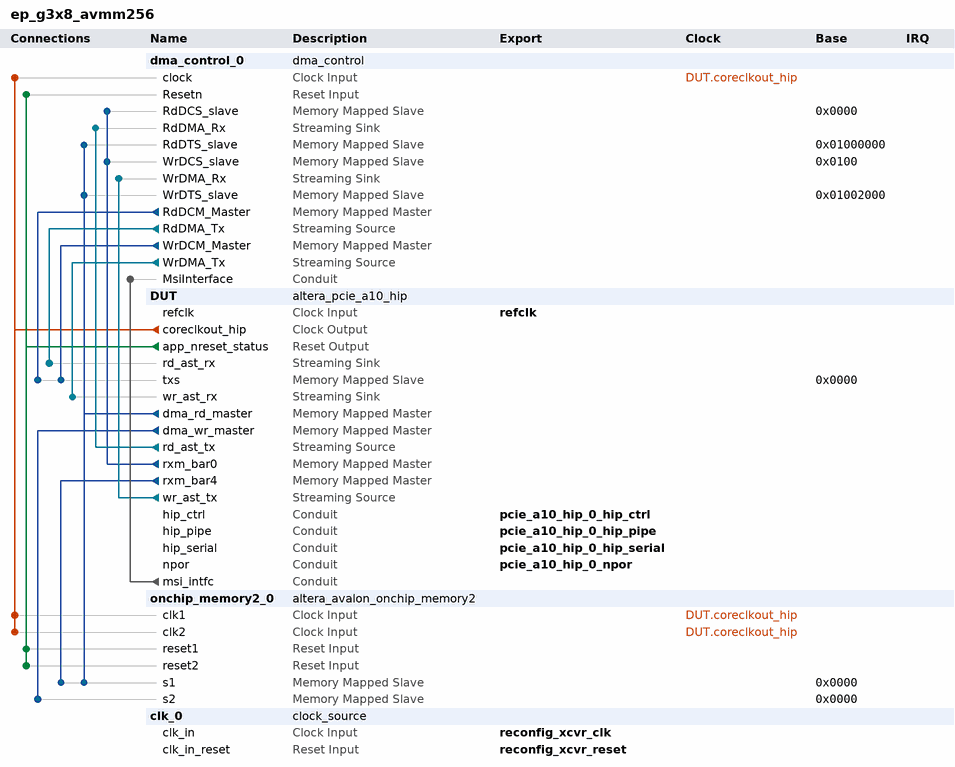
[diagram p0: system contents]
# Platform Designer (Qsys) system ep_g3x8_avmm256, Arria 10 10AT115S2F45E2SG
# Parameters at their usual value, and those the tool derives, are not listed.
package require -exact qsys 1.0
create_system ep_g3x8_avmm256
set_project_property DEVICE_FAMILY {Arria 10}
set_project_property DEVICE 10AT115S2F45E2SG

add_component dma_control_0 ip/ep_g3x8_avmm256/ep_g3x8_avmm256_dma_control_0.ip dma_control dma_control_0 17.1
load_component dma_control_0
set_component_parameter_value DMA_WIDTH 256
save_component

add_component DUT ip/ep_g3x8_avmm256/ep_g3x8_avmm256_DUT.ip altera_pcie_a10_hip DUT 17.1
load_component DUT
set_component_parameter_value interface_type_hwtcl {Avalon-MM with DMA}
set_component_parameter_value force_tag_checking_on_hwtcl 0
set_component_parameter_value app_interface_width_hwtcl 256-bit
set_component_parameter_value wrala_hwtcl 0
set_component_parameter_value base_device NIGHTFURY5
set_component_parameter_value part_trait_device 10AT115S2F45E2SG
set_component_parameter_value bar0_address_width_mux_hwtcl 9
set_component_parameter_value bar1_address_width_mux_hwtcl 0
set_component_parameter_value bar2_address_width_mux_hwtcl 0
set_component_parameter_value bar3_address_width_mux_hwtcl 0
set_component_parameter_value bar4_address_width_mux_hwtcl 15
set_component_parameter_value bar5_address_width_mux_hwtcl 0
set_component_parameter_value st_signal_width_integer_hwtcl 1
set_component_parameter_value data_width_integer_hwtcl 256
set_component_parameter_value data_width_integer_rxm_txs_hwtcl 32
set_component_parameter_value data_width_integer_txs_hwtcl 32
set_component_parameter_value data_byte_width_integer_hwtcl 32
set_component_parameter_value reconfig_address_width_integer_hwtcl 13
set_component_parameter_value data_byte_width_integer_rxm_txs_hwtcl 4
set_component_parameter_value data_byte_width_integer_txs_hwtcl 4
set_component_parameter_value burst_count_integer_hwtcl 5
set_component_parameter_value empty_integer_hwtcl 2
set_component_parameter_value port_type_integer_hwtcl 0
set_component_parameter_value link_width_integer_hwtcl 8
set_component_parameter_value lane_rate_integer_hwtcl 3
set_component_parameter_value pld_clk_mhz_integer_hwtcl 2500
set_component_parameter_value bar0_type_integer_hwtcl 1
set_component_parameter_value bar1_type_integer_hwtcl 0
set_component_parameter_value bar2_type_integer_hwtcl 0
set_component_parameter_value bar3_type_integer_hwtcl 0
set_component_parameter_value bar4_type_integer_hwtcl 1
set_component_parameter_value bar5_type_integer_hwtcl 0
set_component_parameter_value include_dma_hwtcl 1
set_component_parameter_value txs_addr_width_integer_hwtcl 32
set_component_parameter_value interface_type_integer_hwtcl 1
set_component_parameter_value dma_width_hwtcl 256
set_component_parameter_value dma_be_width_hwtcl 32
set_component_parameter_value dma_brst_cnt_w_hwtcl 5
set_component_parameter_value set_embedded_debug_enable_hwtcl 0
set_component_parameter_value set_capability_reg_enable_hwtcl 0
set_component_parameter_value set_csr_soft_logic_enable_hwtcl 0
set_component_parameter_value set_prbs_soft_logic_enable_hwtcl 0
set_component_parameter_value rcfg_jtag_enable_hwtcl 0
set_component_parameter_value cpl_spc_header_hwtcl 195
set_component_parameter_value cpl_spc_data_hwtcl 773
set_component_parameter_value avmm_addr_width_hwtcl 64
set_component_parameter_value cg_enable_advanced_interrupt_hwtcl 1
set_component_parameter_value cg_enable_a2p_interrupt_hwtcl 0
set_component_parameter_value enable_hip_status_for_avmm_hwtcl 0
set_component_parameter_value internal_controller_hwtcl 0
set_component_parameter_value enable_rxm_burst_hwtcl 0
set_component_parameter_value extended_tag_support_hwtcl 0
set_component_parameter_value user_txs_addr_width_hwtcl 32
set_component_parameter_value cg_a2p_addr_map_pass_thru_bits_hwtcl 20
set_component_parameter_value link_width_hwtcl x8
set_component_parameter_value lane_rate_hwtcl {Gen3 (8.0 Gbps)}
set_component_parameter_value rx_buffer_credit_alloc_hwtcl Low
set_component_parameter_value rx_buffer_post_credit_alloc_display {Header:n/a Data:n/a}
set_component_parameter_value rx_buffer_nonpost_credit_alloc_display {Header:n/a Data:n/a}
set_component_parameter_value rx_buffer_credit_alloc_display {Header:195 Data:773}
set_component_parameter_value rx_cred_ctl_param_hwtcl 0
set_component_parameter_value set_pld_clk_x1_625MHz_hwtcl 0
set_component_parameter_value enable_avst_reset_hwtcl 0
set_component_parameter_value cseb_config_bypass_gui_hwtcl 0
set_component_parameter_value cseb_config_bypass_hwtcl 0
set_component_parameter_value cseb_autonomous_hwtcl 0
set_component_parameter_value speed_change_hwtcl 0
set_component_parameter_value xcvr_reconfig_hwtcl 0
set_component_parameter_value export_fpll_output_to_top_level_hwtcl 0
set_component_parameter_value export_phy_input_to_top_level_hwtcl 0
set_component_parameter_value enable_lmi_hwtcl 0
set_component_parameter_value adme_enable_hwtcl 0
set_component_parameter_value enable_devkit_conduit_hwtcl 0
set_component_parameter_value enable_skp_det 0
set_component_parameter_value dis_adapt 0
set_component_parameter_value select_design_example_hwtcl DMA
set_component_parameter_value enable_example_design_qii_hwtcl 0
set_component_parameter_value enable_example_design_sim_hwtcl 0
set_component_parameter_value enable_example_design_synth_hwtcl 0
set_component_parameter_value enable_example_design_tb_hwtcl 0
set_component_parameter_value apps_type_hwtcl 0
set_component_parameter_value select_design_example_rtl_lang_hwtcl Verilog
set_component_parameter_value targeted_devkit_hwtcl {Arria 10 GX FPGA Development Kit}
set_component_parameter_value bar0_type_hwtcl {64-bit prefetchable memory}
set_component_parameter_value bar0_address_width_hwtcl 28
set_component_parameter_value bar1_type_hwtcl Disabled
set_component_parameter_value bar1_address_width_hwtcl 0
set_component_parameter_value bar2_type_hwtcl Disabled
set_component_parameter_value bar2_address_width_hwtcl 0
set_component_parameter_value bar3_type_hwtcl Disabled
set_component_parameter_value bar3_address_width_hwtcl 0
set_component_parameter_value bar4_type_hwtcl {64-bit prefetchable memory}
set_component_parameter_value bar0_address_width_avmm_hwtcl 9
set_component_parameter_value bar1_address_width_avmm_hwtcl 0
set_component_parameter_value bar2_address_width_avmm_hwtcl 0
set_component_parameter_value bar3_address_width_avmm_hwtcl 0
set_component_parameter_value bar4_address_width_avmm_hwtcl 15
set_component_parameter_value bar5_address_width_avmm_hwtcl 0
set_component_parameter_value eco_fb332688_dis_hwtcl 0
set_component_parameter_value vendor_id_hwtcl 4466
set_component_parameter_value device_id_hwtcl 57345
set_component_parameter_value pf0_vf_device_id_hwtcl 0
set_component_parameter_value revision_id_hwtcl 0
set_component_parameter_value class_code_hwtcl 0
set_component_parameter_value pf0_subclass_code_hwtcl 0
set_component_parameter_value pf0_pci_prog_intfc_byte_hwtcl 0
set_component_parameter_value subsystem_vendor_id_hwtcl 0
set_component_parameter_value subsystem_device_id_hwtcl 0
set_component_parameter_value maximum_payload_size_hwtcl 256
set_component_parameter_value completion_timeout_hwtcl NONE
set_component_parameter_value enable_completion_timeout_disable_hwtcl 1
set_component_parameter_value advance_error_reporting_hwtcl 0
set_component_parameter_value ecrc_check_capable_hwtcl 0
set_component_parameter_value ecrc_gen_capable_hwtcl 0
set_component_parameter_value slot_clock_cfg_hwtcl 1
set_component_parameter_value vsec_id_hwtcl 4466
set_component_parameter_value vsec_cap_hwtcl 0
set_component_parameter_value user_id_hwtcl 0
set_component_parameter_value gen3_coeff_1_hwtcl 9
set_component_parameter_value bfm_drive_interface_clk_hwtcl 1
set_component_parameter_value bfm_drive_interface_npor_hwtcl 1
set_component_parameter_value bfm_drive_interface_pipe_hwtcl 1
set_component_parameter_value bfm_drive_interface_control_hwtcl 1
set_component_parameter_value reserved_debug_hwtcl 0
set_component_parameter_value include_sriov_hwtcl 0
set_component_parameter_value app_msi_req_fn_hwtcl 8
set_component_parameter_value cfg_num_vf_width_hwtcl 8
set_component_parameter_value flr_completed_vf_width_hwtcl 4
set_component_parameter_value sriov2_en 0
set_component_parameter_value enable_nobar_slection_hwtcl 0
set_component_parameter_value enable_custom_features_hwtcl 0
set_component_parameter_value pf0_extra_bar_present_hwtcl 0
set_component_parameter_value pf0_extra_bar_size_hwtcl 12
set_component_parameter_value devhide_support_hwtcl 0
set_component_parameter_value device_embedded_ep_support_hwtcl 0
set_component_parameter_value total_pf_count_hwtcl 1
set_component_parameter_value pf0_vf_count_user_hwtcl 0
set_component_parameter_value pf1_vf_count_user_hwtcl 0
set_component_parameter_value pf2_vf_count_user_hwtcl 0
set_component_parameter_value pf3_vf_count_user_hwtcl 0
set_component_parameter_value pf0_vf_count_hwtcl 0
set_component_parameter_value pf1_vf_count_hwtcl 0
set_component_parameter_value pf2_vf_count_hwtcl 0
set_component_parameter_value pf3_vf_count_hwtcl 0
set_component_parameter_value total_vf_count_hwtcl 4
set_component_parameter_value total_pf_count_width_hwtcl 1
set_component_parameter_value total_vf_count_width_hwtcl 1
set_component_parameter_value system_page_sizes_supported_hwtcl 1363
set_component_parameter_value sr_iov_support_hwtcl 0
set_component_parameter_value include_virtio_capabilities_hwtcl 0
set_component_parameter_value ari_support_hwtcl 0
set_component_parameter_value flr_capability_user_hwtcl 0
set_component_parameter_value flr_capability_hwtcl 0
set_component_parameter_value pf0_virtio_capability_present_hwtcl 0
set_component_parameter_value pf0_virtio_device_specific_cap_present_hwtcl 0
set_component_parameter_value pf0_virtio_cmn_config_bar_indicator_hwtcl 0
set_component_parameter_value pf0_virtio_cmn_config_bar_offset_hwtcl 0
set_component_parameter_value pf0_virtio_cmn_config_structure_length_hwtcl 0
set_component_parameter_value pf0_virtio_notification_bar_indicator_hwtcl 0
set_component_parameter_value pf0_virtio_notification_bar_offset_hwtcl 0
set_component_parameter_value pf0_virtio_notification_structure_length_hwtcl 0
set_component_parameter_value pf0_virtio_notify_off_multiplier_hwtcl 0
set_component_parameter_value pf0_virtio_isrstatus_bar_indicator_hwtcl 0
set_component_parameter_value pf0_virtio_isrstatus_bar_offset_hwtcl 0
set_component_parameter_value pf0_virtio_isrstatus_structure_length_hwtcl 0
set_component_parameter_value pf0_virtio_devspecific_bar_indicator_hwtcl 0
set_component_parameter_value pf0_virtio_devspecific_bar_offset_hwtcl 0
set_component_parameter_value pf0_virtio_devspecific_structure_length_hwtcl 0
set_component_parameter_value pf0_virtio_pciconfig_access_bar_indicator_hwtcl 0
set_component_parameter_value pf0_virtio_pciconfig_access_bar_offset_hwtcl 0
set_component_parameter_value pf0_virtio_pciconfig_access_structure_length_hwtcl 0
set_component_parameter_value pf1_virtio_capability_present_hwtcl 0
set_component_parameter_value pf1_virtio_device_specific_cap_present_hwtcl 0
set_component_parameter_value pf1_virtio_cmn_config_bar_indicator_hwtcl 0
set_component_parameter_value pf1_virtio_cmn_config_bar_offset_hwtcl 0
set_component_parameter_value pf1_virtio_cmn_config_structure_length_hwtcl 0
set_component_parameter_value pf1_virtio_notification_bar_indicator_hwtcl 0
set_component_parameter_value pf1_virtio_notification_bar_offset_hwtcl 0
set_component_parameter_value pf1_virtio_notification_structure_length_hwtcl 0
set_component_parameter_value pf1_virtio_notify_off_multiplier_hwtcl 0
set_component_parameter_value pf1_virtio_isrstatus_bar_indicator_hwtcl 0
set_component_parameter_value pf1_virtio_isrstatus_bar_offset_hwtcl 0
set_component_parameter_value pf1_virtio_isrstatus_structure_length_hwtcl 0
set_component_parameter_value pf1_virtio_devspecific_bar_indicator_hwtcl 0
set_component_parameter_value pf1_virtio_devspecific_bar_offset_hwtcl 0
set_component_parameter_value pf1_virtio_devspecific_structure_length_hwtcl 0
set_component_parameter_value pf1_virtio_pciconfig_access_bar_indicator_hwtcl 0
set_component_parameter_value pf1_virtio_pciconfig_access_bar_offset_hwtcl 0
set_component_parameter_value pf1_virtio_pciconfig_access_structure_length_hwtcl 0
set_component_parameter_value pf2_virtio_capability_present_hwtcl 0
set_component_parameter_value pf2_virtio_device_specific_cap_present_hwtcl 0
set_component_parameter_value pf2_virtio_cmn_config_bar_indicator_hwtcl 0
set_component_parameter_value pf2_virtio_cmn_config_bar_offset_hwtcl 0
set_component_parameter_value pf2_virtio_cmn_config_structure_length_hwtcl 0
set_component_parameter_value pf2_virtio_notification_bar_indicator_hwtcl 0
set_component_parameter_value pf2_virtio_notification_bar_offset_hwtcl 0
set_component_parameter_value pf2_virtio_notification_structure_length_hwtcl 0
set_component_parameter_value pf2_virtio_notify_off_multiplier_hwtcl 0
set_component_parameter_value pf2_virtio_isrstatus_bar_indicator_hwtcl 0
set_component_parameter_value pf2_virtio_isrstatus_bar_offset_hwtcl 0
set_component_parameter_value pf2_virtio_isrstatus_structure_length_hwtcl 0
set_component_parameter_value pf2_virtio_devspecific_bar_indicator_hwtcl 0
set_component_parameter_value pf2_virtio_devspecific_bar_offset_hwtcl 0
set_component_parameter_value pf2_virtio_devspecific_structure_length_hwtcl 0
set_component_parameter_value pf2_virtio_pciconfig_access_bar_indicator_hwtcl 0
set_component_parameter_value pf2_virtio_pciconfig_access_bar_offset_hwtcl 0
set_component_parameter_value pf2_virtio_pciconfig_access_structure_length_hwtcl 0
set_component_parameter_value pf3_virtio_capability_present_hwtcl 0
set_component_parameter_value pf3_virtio_device_specific_cap_present_hwtcl 0
set_component_parameter_value pf3_virtio_cmn_config_bar_indicator_hwtcl 0
set_component_parameter_value pf3_virtio_cmn_config_bar_offset_hwtcl 0
set_component_parameter_value pf3_virtio_cmn_config_structure_length_hwtcl 0
set_component_parameter_value pf3_virtio_notification_bar_indicator_hwtcl 0
set_component_parameter_value pf3_virtio_notification_bar_offset_hwtcl 0
set_component_parameter_value pf3_virtio_notification_structure_length_hwtcl 0
set_component_parameter_value pf3_virtio_notify_off_multiplier_hwtcl 0
set_component_parameter_value pf3_virtio_isrstatus_bar_indicator_hwtcl 0
set_component_parameter_value pf3_virtio_isrstatus_bar_offset_hwtcl 0
set_component_parameter_value pf3_virtio_isrstatus_structure_length_hwtcl 0
set_component_parameter_value pf3_virtio_devspecific_bar_indicator_hwtcl 0
set_component_parameter_value pf3_virtio_devspecific_bar_offset_hwtcl 0
set_component_parameter_value pf3_virtio_devspecific_structure_length_hwtcl 0
set_component_parameter_value pf3_virtio_pciconfig_access_bar_indicator_hwtcl 0
set_component_parameter_value pf3_virtio_pciconfig_access_bar_offset_hwtcl 0
set_component_parameter_value pf3_virtio_pciconfig_access_structure_length_hwtcl 0
set_component_parameter_value pf4_virtio_capability_present_hwtcl 0
set_component_parameter_value pf4_virtio_device_specific_cap_present_hwtcl 0
set_component_parameter_value pf4_virtio_cmn_config_bar_indicator_hwtcl 0
set_component_parameter_value pf4_virtio_cmn_config_bar_offset_hwtcl 0
set_component_parameter_value pf4_virtio_cmn_config_structure_length_hwtcl 0
set_component_parameter_value pf4_virtio_notification_bar_indicator_hwtcl 0
set_component_parameter_value pf4_virtio_notification_bar_offset_hwtcl 0
set_component_parameter_value pf4_virtio_notification_structure_length_hwtcl 0
set_component_parameter_value pf4_virtio_notify_off_multiplier_hwtcl 0
set_component_parameter_value pf4_virtio_isrstatus_bar_indicator_hwtcl 0
set_component_parameter_value pf4_virtio_isrstatus_bar_offset_hwtcl 0
set_component_parameter_value pf4_virtio_isrstatus_structure_length_hwtcl 0
set_component_parameter_value pf4_virtio_devspecific_bar_indicator_hwtcl 0
set_component_parameter_value pf4_virtio_devspecific_bar_offset_hwtcl 0
set_component_parameter_value pf4_virtio_devspecific_structure_length_hwtcl 0
set_component_parameter_value pf4_virtio_pciconfig_access_bar_indicator_hwtcl 0
set_component_parameter_value pf4_virtio_pciconfig_access_bar_offset_hwtcl 0
set_component_parameter_value pf4_virtio_pciconfig_access_structure_length_hwtcl 0
set_component_parameter_value pf5_virtio_capability_present_hwtcl 0
set_component_parameter_value pf5_virtio_device_specific_cap_present_hwtcl 0
set_component_parameter_value pf5_virtio_cmn_config_bar_indicator_hwtcl 0
set_component_parameter_value pf5_virtio_cmn_config_bar_offset_hwtcl 0
set_component_parameter_value pf5_virtio_cmn_config_structure_length_hwtcl 0
set_component_parameter_value pf5_virtio_notification_bar_indicator_hwtcl 0
set_component_parameter_value pf5_virtio_notification_bar_offset_hwtcl 0
set_component_parameter_value pf5_virtio_notification_structure_length_hwtcl 0
set_component_parameter_value pf5_virtio_notify_off_multiplier_hwtcl 0
set_component_parameter_value pf5_virtio_isrstatus_bar_indicator_hwtcl 0
set_component_parameter_value pf5_virtio_isrstatus_bar_offset_hwtcl 0
set_component_parameter_value pf5_virtio_isrstatus_structure_length_hwtcl 0
set_component_parameter_value pf5_virtio_devspecific_bar_indicator_hwtcl 0
set_component_parameter_value pf5_virtio_devspecific_bar_offset_hwtcl 0
set_component_parameter_value pf5_virtio_devspecific_structure_length_hwtcl 0
set_component_parameter_value pf5_virtio_pciconfig_access_bar_indicator_hwtcl 0
set_component_parameter_value pf5_virtio_pciconfig_access_bar_offset_hwtcl 0
set_component_parameter_value pf5_virtio_pciconfig_access_structure_length_hwtcl 0
set_component_parameter_value pf6_virtio_capability_present_hwtcl 0
set_component_parameter_value pf6_virtio_device_specific_cap_present_hwtcl 0
set_component_parameter_value pf6_virtio_cmn_config_bar_indicator_hwtcl 0
set_component_parameter_value pf6_virtio_cmn_config_bar_offset_hwtcl 0
set_component_parameter_value pf6_virtio_cmn_config_structure_length_hwtcl 0
set_component_parameter_value pf6_virtio_notification_bar_indicator_hwtcl 0
set_component_parameter_value pf6_virtio_notification_bar_offset_hwtcl 0
set_component_parameter_value pf6_virtio_notification_structure_length_hwtcl 0
set_component_parameter_value pf6_virtio_notify_off_multiplier_hwtcl 0
set_component_parameter_value pf6_virtio_isrstatus_bar_indicator_hwtcl 0
set_component_parameter_value pf6_virtio_isrstatus_bar_offset_hwtcl 0
set_component_parameter_value pf6_virtio_isrstatus_structure_length_hwtcl 0
set_component_parameter_value pf6_virtio_devspecific_bar_indicator_hwtcl 0
set_component_parameter_value pf6_virtio_devspecific_bar_offset_hwtcl 0
set_component_parameter_value pf6_virtio_devspecific_structure_length_hwtcl 0
set_component_parameter_value pf6_virtio_pciconfig_access_bar_indicator_hwtcl 0
set_component_parameter_value pf6_virtio_pciconfig_access_bar_offset_hwtcl 0
set_component_parameter_value pf6_virtio_pciconfig_access_structure_length_hwtcl 0
set_component_parameter_value pf7_virtio_capability_present_hwtcl 0
set_component_parameter_value pf7_virtio_device_specific_cap_present_hwtcl 0
set_component_parameter_value pf7_virtio_cmn_config_bar_indicator_hwtcl 0
set_component_parameter_value pf7_virtio_cmn_config_bar_offset_hwtcl 0
set_component_parameter_value pf7_virtio_cmn_config_structure_length_hwtcl 0
set_component_parameter_value pf7_virtio_notification_bar_indicator_hwtcl 0
set_component_parameter_value pf7_virtio_notification_bar_offset_hwtcl 0
set_component_parameter_value pf7_virtio_notification_structure_length_hwtcl 0
set_component_parameter_value pf7_virtio_notify_off_multiplier_hwtcl 0
set_component_parameter_value pf7_virtio_isrstatus_bar_indicator_hwtcl 0
set_component_parameter_value pf7_virtio_isrstatus_bar_offset_hwtcl 0
set_component_parameter_value pf7_virtio_isrstatus_structure_length_hwtcl 0
set_component_parameter_value pf7_virtio_devspecific_bar_indicator_hwtcl 0
set_component_parameter_value pf7_virtio_devspecific_bar_offset_hwtcl 0
set_component_parameter_value pf7_virtio_devspecific_structure_length_hwtcl 0
set_component_parameter_value pf7_virtio_pciconfig_access_bar_indicator_hwtcl 0
set_component_parameter_value pf7_virtio_pciconfig_access_bar_offset_hwtcl 0
set_component_parameter_value pf7_virtio_pciconfig_access_structure_length_hwtcl 0
set_component_parameter_value pf_tph_support_hwtcl 0
set_component_parameter_value pf0_tph_int_mode_support_hwtcl 0
set_component_parameter_value pf0_tph_dev_specific_mode_support_hwtcl 0
set_component_parameter_value pf0_tph_st_table_location_hwtcl 0
set_component_parameter_value pf0_tph_st_table_size_hwtcl 63
set_component_parameter_value pf1_tph_int_mode_support_hwtcl 0
set_component_parameter_value pf1_tph_dev_specific_mode_support_hwtcl 0
set_component_parameter_value pf1_tph_st_table_location_hwtcl 0
set_component_parameter_value pf1_tph_st_table_size_hwtcl 63
set_component_parameter_value pf2_tph_int_mode_support_hwtcl 0
set_component_parameter_value pf2_tph_dev_specific_mode_support_hwtcl 0
set_component_parameter_value pf2_tph_st_table_location_hwtcl 0
set_component_parameter_value pf2_tph_st_table_size_hwtcl 63
set_component_parameter_value pf3_tph_int_mode_support_hwtcl 0
set_component_parameter_value pf3_tph_dev_specific_mode_support_hwtcl 0
set_component_parameter_value pf3_tph_st_table_location_hwtcl 0
set_component_parameter_value pf3_tph_st_table_size_hwtcl 63
set_component_parameter_value vf_tph_support_hwtcl 0
set_component_parameter_value pf0_vf_tph_int_mode_support_hwtcl 0
set_component_parameter_value pf0_vf_tph_dev_specific_mode_support_hwtcl 0
set_component_parameter_value pf0_vf_tph_st_table_location_hwtcl 0
set_component_parameter_value pf0_vf_tph_st_table_size_hwtcl 63
set_component_parameter_value pf1_vf_tph_int_mode_support_hwtcl 0
set_component_parameter_value pf1_vf_tph_dev_specific_mode_support_hwtcl 0
set_component_parameter_value pf1_vf_tph_st_table_location_hwtcl 0
set_component_parameter_value pf1_vf_tph_st_table_size_hwtcl 63
set_component_parameter_value pf2_vf_tph_int_mode_support_hwtcl 0
set_component_parameter_value pf2_vf_tph_dev_specific_mode_support_hwtcl 0
set_component_parameter_value pf2_vf_tph_st_table_location_hwtcl 0
set_component_parameter_value pf2_vf_tph_st_table_size_hwtcl 63
set_component_parameter_value pf3_vf_tph_int_mode_support_hwtcl 0
set_component_parameter_value pf3_vf_tph_dev_specific_mode_support_hwtcl 0
set_component_parameter_value pf3_vf_tph_st_table_location_hwtcl 0
set_component_parameter_value pf3_vf_tph_st_table_size_hwtcl 63
set_component_parameter_value pf_ats_support_hwtcl 0
set_component_parameter_value pf0_ats_invalidate_queue_depth_hwtcl 0
set_component_parameter_value pf1_ats_invalidate_queue_depth_hwtcl 0
set_component_parameter_value pf2_ats_invalidate_queue_depth_hwtcl 0
set_component_parameter_value pf3_ats_invalidate_queue_depth_hwtcl 0
set_component_parameter_value vf_ats_support_hwtcl 0
set_component_parameter_value pf0_bar0_present_hwtcl 1
set_component_parameter_value pf0_bar1_present_hwtcl 0
set_component_parameter_value pf0_bar2_present_hwtcl 0
set_component_parameter_value pf0_bar3_present_hwtcl 0
set_component_parameter_value pf0_bar4_present_hwtcl 0
set_component_parameter_value pf0_bar5_present_hwtcl 0
set_component_parameter_value pf0_exprom_bar_present_hwtcl 0
set_component_parameter_value pf0_bar0_type_hwtcl 1
set_component_parameter_value pf0_bar2_type_hwtcl 1
set_component_parameter_value pf0_bar4_type_hwtcl 1
set_component_parameter_value pf0_bar0_prefetchable_hwtcl 1
set_component_parameter_value pf0_bar1_prefetchable_hwtcl 1
set_component_parameter_value pf0_bar2_prefetchable_hwtcl 1
set_component_parameter_value pf0_bar3_prefetchable_hwtcl 1
set_component_parameter_value pf0_bar4_prefetchable_hwtcl 1
set_component_parameter_value pf0_bar5_prefetchable_hwtcl 1
set_component_parameter_value pf0_bar0_size_hwtcl 12
set_component_parameter_value pf0_bar1_size_hwtcl 12
set_component_parameter_value pf0_bar2_size_hwtcl 12
set_component_parameter_value pf0_bar3_size_hwtcl 12
set_component_parameter_value pf0_bar4_size_hwtcl 12
set_component_parameter_value pf0_bar5_size_hwtcl 12
set_component_parameter_value pf0_exprom_bar_size_hwtcl 12
set_component_parameter_value pf0_vf_bar0_present_hwtcl 0
set_component_parameter_value pf0_vf_bar1_present_hwtcl 0
set_component_parameter_value pf0_vf_bar2_present_hwtcl 0
set_component_parameter_value pf0_vf_bar3_present_hwtcl 0
set_component_parameter_value pf0_vf_bar4_present_hwtcl 0
set_component_parameter_value pf0_vf_bar5_present_hwtcl 0
set_component_parameter_value pf0_vf_bar0_type_hwtcl 1
set_component_parameter_value pf0_vf_bar2_type_hwtcl 1
set_component_parameter_value pf0_vf_bar4_type_hwtcl 1
set_component_parameter_value pf0_vf_bar0_prefetchable_hwtcl 1
set_component_parameter_value pf0_vf_bar1_prefetchable_hwtcl 1
set_component_parameter_value pf0_vf_bar2_prefetchable_hwtcl 1
set_component_parameter_value pf0_vf_bar3_prefetchable_hwtcl 1
set_component_parameter_value pf0_vf_bar4_prefetchable_hwtcl 1
set_component_parameter_value pf0_vf_bar5_prefetchable_hwtcl 1
set_component_parameter_value pf0_vf_bar0_size_hwtcl 12
set_component_parameter_value pf0_vf_bar1_size_hwtcl 12
set_component_parameter_value pf0_vf_bar2_size_hwtcl 12
set_component_parameter_value pf0_vf_bar3_size_hwtcl 12
set_component_parameter_value pf0_vf_bar4_size_hwtcl 12
set_component_parameter_value pf0_vf_bar5_size_hwtcl 12
set_component_parameter_value pf1_bar0_present_hwtcl 0
set_component_parameter_value pf1_bar1_present_hwtcl 0
set_component_parameter_value pf1_bar2_present_hwtcl 0
set_component_parameter_value pf1_bar3_present_hwtcl 0
set_component_parameter_value pf1_bar4_present_hwtcl 0
set_component_parameter_value pf1_bar5_present_hwtcl 0
set_component_parameter_value pf1_exprom_bar_present_hwtcl 0
set_component_parameter_value pf1_bar0_type_hwtcl 1
set_component_parameter_value pf1_bar2_type_hwtcl 1
set_component_parameter_value pf1_bar4_type_hwtcl 1
set_component_parameter_value pf1_bar0_prefetchable_hwtcl 1
set_component_parameter_value pf1_bar1_prefetchable_hwtcl 1
set_component_parameter_value pf1_bar2_prefetchable_hwtcl 1
set_component_parameter_value pf1_bar3_prefetchable_hwtcl 1
set_component_parameter_value pf1_bar4_prefetchable_hwtcl 1
set_component_parameter_value pf1_bar5_prefetchable_hwtcl 1
set_component_parameter_value pf1_bar0_size_hwtcl 12
set_component_parameter_value pf1_bar1_size_hwtcl 12
set_component_parameter_value pf1_bar2_size_hwtcl 12
set_component_parameter_value pf1_bar3_size_hwtcl 12
set_component_parameter_value pf1_bar4_size_hwtcl 12
set_component_parameter_value pf1_bar5_size_hwtcl 12
set_component_parameter_value pf1_exprom_bar_size_hwtcl 12
set_component_parameter_value pf1_vf_bar0_present_hwtcl 0
set_component_parameter_value pf1_vf_bar1_present_hwtcl 0
set_component_parameter_value pf1_vf_bar2_present_hwtcl 0
set_component_parameter_value pf1_vf_bar3_present_hwtcl 0
set_component_parameter_value pf1_vf_bar4_present_hwtcl 0
set_component_parameter_value pf1_vf_bar5_present_hwtcl 0
set_component_parameter_value pf1_vf_bar0_type_hwtcl 1
set_component_parameter_value pf1_vf_bar2_type_hwtcl 1
set_component_parameter_value pf1_vf_bar4_type_hwtcl 1
set_component_parameter_value pf1_vf_bar0_prefetchable_hwtcl 1
set_component_parameter_value pf1_vf_bar1_prefetchable_hwtcl 1
set_component_parameter_value pf1_vf_bar2_prefetchable_hwtcl 1
set_component_parameter_value pf1_vf_bar3_prefetchable_hwtcl 1
set_component_parameter_value pf1_vf_bar4_prefetchable_hwtcl 1
set_component_parameter_value pf1_vf_bar5_prefetchable_hwtcl 1
set_component_parameter_value pf1_vf_bar0_size_hwtcl 12
set_component_parameter_value pf1_vf_bar1_size_hwtcl 12
set_component_parameter_value pf1_vf_bar2_size_hwtcl 12
set_component_parameter_value pf1_vf_bar3_size_hwtcl 12
set_component_parameter_value pf1_vf_bar4_size_hwtcl 12
set_component_parameter_value pf1_vf_bar5_size_hwtcl 12
set_component_parameter_value pf2_bar0_present_hwtcl 0
set_component_parameter_value pf2_bar1_present_hwtcl 0
set_component_parameter_value pf2_bar2_present_hwtcl 0
set_component_parameter_value pf2_bar3_present_hwtcl 0
set_component_parameter_value pf2_bar4_present_hwtcl 0
set_component_parameter_value pf2_bar5_present_hwtcl 0
set_component_parameter_value pf2_exprom_bar_present_hwtcl 0
set_component_parameter_value pf2_bar0_type_hwtcl 1
set_component_parameter_value pf2_bar2_type_hwtcl 1
set_component_parameter_value pf2_bar4_type_hwtcl 1
set_component_parameter_value pf2_bar0_prefetchable_hwtcl 1
set_component_parameter_value pf2_bar1_prefetchable_hwtcl 1
set_component_parameter_value pf2_bar2_prefetchable_hwtcl 1
set_component_parameter_value pf2_bar3_prefetchable_hwtcl 1
set_component_parameter_value pf2_bar4_prefetchable_hwtcl 1
set_component_parameter_value pf2_bar5_prefetchable_hwtcl 1
set_component_parameter_value pf2_bar0_size_hwtcl 12
set_component_parameter_value pf2_bar1_size_hwtcl 12
set_component_parameter_value pf2_bar2_size_hwtcl 12
set_component_parameter_value pf2_bar3_size_hwtcl 12
set_component_parameter_value pf2_bar4_size_hwtcl 12
set_component_parameter_value pf2_bar5_size_hwtcl 12
set_component_parameter_value pf2_exprom_bar_size_hwtcl 12
set_component_parameter_value pf2_vf_bar0_present_hwtcl 0
set_component_parameter_value pf2_vf_bar1_present_hwtcl 0
set_component_parameter_value pf2_vf_bar2_present_hwtcl 0
set_component_parameter_value pf2_vf_bar3_present_hwtcl 0
set_component_parameter_value pf2_vf_bar4_present_hwtcl 0
set_component_parameter_value pf2_vf_bar5_present_hwtcl 0
set_component_parameter_value pf2_vf_bar0_type_hwtcl 1
set_component_parameter_value pf2_vf_bar2_type_hwtcl 1
set_component_parameter_value pf2_vf_bar4_type_hwtcl 1
set_component_parameter_value pf2_vf_bar0_prefetchable_hwtcl 1
set_component_parameter_value pf2_vf_bar1_prefetchable_hwtcl 1
set_component_parameter_value pf2_vf_bar2_prefetchable_hwtcl 1
set_component_parameter_value pf2_vf_bar3_prefetchable_hwtcl 1
set_component_parameter_value pf2_vf_bar4_prefetchable_hwtcl 1
set_component_parameter_value pf2_vf_bar5_prefetchable_hwtcl 1
set_component_parameter_value pf2_vf_bar0_size_hwtcl 12
set_component_parameter_value pf2_vf_bar1_size_hwtcl 12
set_component_parameter_value pf2_vf_bar2_size_hwtcl 12
set_component_parameter_value pf2_vf_bar3_size_hwtcl 12
set_component_parameter_value pf2_vf_bar4_size_hwtcl 12
set_component_parameter_value pf2_vf_bar5_size_hwtcl 12
set_component_parameter_value pf3_bar0_present_hwtcl 0
set_component_parameter_value pf3_bar1_present_hwtcl 0
set_component_parameter_value pf3_bar2_present_hwtcl 0
set_component_parameter_value pf3_bar3_present_hwtcl 0
set_component_parameter_value pf3_bar4_present_hwtcl 0
set_component_parameter_value pf3_bar5_present_hwtcl 0
set_component_parameter_value pf3_exprom_bar_present_hwtcl 0
set_component_parameter_value pf3_bar0_type_hwtcl 1
set_component_parameter_value pf3_bar2_type_hwtcl 1
set_component_parameter_value pf3_bar4_type_hwtcl 1
set_component_parameter_value pf3_bar0_prefetchable_hwtcl 1
set_component_parameter_value pf3_bar1_prefetchable_hwtcl 1
set_component_parameter_value pf3_bar2_prefetchable_hwtcl 1
set_component_parameter_value pf3_bar3_prefetchable_hwtcl 1
set_component_parameter_value pf3_bar4_prefetchable_hwtcl 1
set_component_parameter_value pf3_bar5_prefetchable_hwtcl 1
set_component_parameter_value pf3_bar0_size_hwtcl 12
set_component_parameter_value pf3_bar1_size_hwtcl 12
set_component_parameter_value pf3_bar2_size_hwtcl 12
set_component_parameter_value pf3_bar3_size_hwtcl 12
set_component_parameter_value pf3_bar4_size_hwtcl 12
set_component_parameter_value pf3_bar5_size_hwtcl 12
set_component_parameter_value pf3_exprom_bar_size_hwtcl 12
set_component_parameter_value pf3_vf_bar0_present_hwtcl 0
set_component_parameter_value pf3_vf_bar1_present_hwtcl 0
set_component_parameter_value pf3_vf_bar2_present_hwtcl 0
set_component_parameter_value pf3_vf_bar3_present_hwtcl 0
set_component_parameter_value pf3_vf_bar4_present_hwtcl 0
set_component_parameter_value pf3_vf_bar5_present_hwtcl 0
set_component_parameter_value pf3_vf_bar0_type_hwtcl 1
set_component_parameter_value pf3_vf_bar2_type_hwtcl 1
set_component_parameter_value pf3_vf_bar4_type_hwtcl 1
set_component_parameter_value pf3_vf_bar0_prefetchable_hwtcl 1
set_component_parameter_value pf3_vf_bar1_prefetchable_hwtcl 1
set_component_parameter_value pf3_vf_bar2_prefetchable_hwtcl 1
set_component_parameter_value pf3_vf_bar3_prefetchable_hwtcl 1
set_component_parameter_value pf3_vf_bar4_prefetchable_hwtcl 1
set_component_parameter_value pf3_vf_bar5_prefetchable_hwtcl 1
set_component_parameter_value pf3_vf_bar0_size_hwtcl 12
set_component_parameter_value pf3_vf_bar1_size_hwtcl 12
set_component_parameter_value pf3_vf_bar2_size_hwtcl 12
set_component_parameter_value pf3_vf_bar3_size_hwtcl 12
set_component_parameter_value pf3_vf_bar4_size_hwtcl 12
set_component_parameter_value pf3_vf_bar5_size_hwtcl 12
set_component_parameter_value pf4_bar0_present_hwtcl 0
set_component_parameter_value pf4_bar1_present_hwtcl 0
set_component_parameter_value pf4_bar2_present_hwtcl 0
set_component_parameter_value pf4_bar3_present_hwtcl 0
set_component_parameter_value pf4_bar4_present_hwtcl 0
set_component_parameter_value pf4_bar5_present_hwtcl 0
set_component_parameter_value pf4_exprom_bar_present_hwtcl 0
set_component_parameter_value pf4_bar0_type_hwtcl 1
set_component_parameter_value pf4_bar2_type_hwtcl 1
set_component_parameter_value pf4_bar4_type_hwtcl 1
set_component_parameter_value pf4_bar0_prefetchable_hwtcl 1
set_component_parameter_value pf4_bar1_prefetchable_hwtcl 1
set_component_parameter_value pf4_bar2_prefetchable_hwtcl 1
set_component_parameter_value pf4_bar3_prefetchable_hwtcl 1
set_component_parameter_value pf4_bar4_prefetchable_hwtcl 1
set_component_parameter_value pf4_bar5_prefetchable_hwtcl 1
set_component_parameter_value pf4_bar0_size_hwtcl 12
set_component_parameter_value pf4_bar1_size_hwtcl 12
set_component_parameter_value pf4_bar2_size_hwtcl 12
set_component_parameter_value pf4_bar3_size_hwtcl 12
set_component_parameter_value pf4_bar4_size_hwtcl 12
set_component_parameter_value pf4_bar5_size_hwtcl 12
set_component_parameter_value pf4_exprom_bar_size_hwtcl 12
set_component_parameter_value pf5_bar0_present_hwtcl 0
set_component_parameter_value pf5_bar1_present_hwtcl 0
set_component_parameter_value pf5_bar2_present_hwtcl 0
set_component_parameter_value pf5_bar3_present_hwtcl 0
set_component_parameter_value pf5_bar4_present_hwtcl 0
set_component_parameter_value pf5_bar5_present_hwtcl 0
set_component_parameter_value pf5_exprom_bar_present_hwtcl 0
set_component_parameter_value pf5_bar0_type_hwtcl 1
set_component_parameter_value pf5_bar2_type_hwtcl 1
set_component_parameter_value pf5_bar4_type_hwtcl 1
set_component_parameter_value pf5_bar0_prefetchable_hwtcl 1
set_component_parameter_value pf5_bar1_prefetchable_hwtcl 1
set_component_parameter_value pf5_bar2_prefetchable_hwtcl 1
set_component_parameter_value pf5_bar3_prefetchable_hwtcl 1
set_component_parameter_value pf5_bar4_prefetchable_hwtcl 1
set_component_parameter_value pf5_bar5_prefetchable_hwtcl 1
set_component_parameter_value pf5_bar0_size_hwtcl 12
set_component_parameter_value pf5_bar1_size_hwtcl 12
set_component_parameter_value pf5_bar2_size_hwtcl 12
set_component_parameter_value pf5_bar3_size_hwtcl 12
set_component_parameter_value pf5_bar4_size_hwtcl 12
set_component_parameter_value pf5_bar5_size_hwtcl 12
set_component_parameter_value pf5_exprom_bar_size_hwtcl 12
set_component_parameter_value pf6_bar0_present_hwtcl 0
set_component_parameter_value pf6_bar1_present_hwtcl 0
set_component_parameter_value pf6_bar2_present_hwtcl 0
set_component_parameter_value pf6_bar3_present_hwtcl 0
set_component_parameter_value pf6_bar4_present_hwtcl 0
set_component_parameter_value pf6_bar5_present_hwtcl 0
set_component_parameter_value pf6_exprom_bar_present_hwtcl 0
set_component_parameter_value pf6_bar0_type_hwtcl 1
set_component_parameter_value pf6_bar2_type_hwtcl 1
set_component_parameter_value pf6_bar4_type_hwtcl 1
set_component_parameter_value pf6_bar0_prefetchable_hwtcl 1
set_component_parameter_value pf6_bar1_prefetchable_hwtcl 1
set_component_parameter_value pf6_bar2_prefetchable_hwtcl 1
set_component_parameter_value pf6_bar3_prefetchable_hwtcl 1
set_component_parameter_value pf6_bar4_prefetchable_hwtcl 1
set_component_parameter_value pf6_bar5_prefetchable_hwtcl 1
set_component_parameter_value pf6_bar0_size_hwtcl 12
set_component_parameter_value pf6_bar1_size_hwtcl 12
set_component_parameter_value pf6_bar2_size_hwtcl 12
set_component_parameter_value pf6_bar3_size_hwtcl 12
set_component_parameter_value pf6_bar4_size_hwtcl 12
set_component_parameter_value pf6_bar5_size_hwtcl 12
set_component_parameter_value pf6_exprom_bar_size_hwtcl 12
set_component_parameter_value pf7_bar0_present_hwtcl 0
set_component_parameter_value pf7_bar1_present_hwtcl 0
set_component_parameter_value pf7_bar2_present_hwtcl 0
set_component_parameter_value pf7_bar3_present_hwtcl 0
set_component_parameter_value pf7_bar4_present_hwtcl 0
set_component_parameter_value pf7_bar5_present_hwtcl 0
set_component_parameter_value pf7_exprom_bar_present_hwtcl 0
set_component_parameter_value pf7_bar0_type_hwtcl 1
set_component_parameter_value pf7_bar2_type_hwtcl 1
set_component_parameter_value pf7_bar4_type_hwtcl 1
set_component_parameter_value pf7_bar0_prefetchable_hwtcl 1
set_component_parameter_value pf7_bar1_prefetchable_hwtcl 1
set_component_parameter_value pf7_bar2_prefetchable_hwtcl 1
set_component_parameter_value pf7_bar3_prefetchable_hwtcl 1
set_component_parameter_value pf7_bar4_prefetchable_hwtcl 1
set_component_parameter_value pf7_bar5_prefetchable_hwtcl 1
set_component_parameter_value pf7_bar0_size_hwtcl 12
set_component_parameter_value pf7_bar1_size_hwtcl 12
set_component_parameter_value pf7_bar2_size_hwtcl 12
set_component_parameter_value pf7_bar3_size_hwtcl 12
set_component_parameter_value pf7_bar4_size_hwtcl 12
set_component_parameter_value pf7_bar5_size_hwtcl 12
set_component_parameter_value pf7_exprom_bar_size_hwtcl 12
set_component_parameter_value pf1_vendor_id_hwtcl 0
set_component_parameter_value pf1_device_id_hwtcl 0
set_component_parameter_value pf1_vf_device_id_hwtcl 0
set_component_parameter_value pf1_revision_id_hwtcl 0
set_component_parameter_value pf1_class_code_hwtcl 0
set_component_parameter_value pf1_subclass_code_hwtcl 0
set_component_parameter_value pf1_pci_prog_intfc_byte_hwtcl 0
set_component_parameter_value pf1_subsystem_vendor_id_hwtcl 0
set_component_parameter_value pf1_subsystem_device_id_hwtcl 0
set_component_parameter_value pf2_vendor_id_hwtcl 0
set_component_parameter_value pf2_device_id_hwtcl 0
set_component_parameter_value pf2_vf_device_id_hwtcl 0
set_component_parameter_value pf2_revision_id_hwtcl 0
set_component_parameter_value pf2_class_code_hwtcl 0
set_component_parameter_value pf2_subclass_code_hwtcl 0
set_component_parameter_value pf2_pci_prog_intfc_byte_hwtcl 0
set_component_parameter_value pf2_subsystem_vendor_id_hwtcl 0
set_component_parameter_value pf2_subsystem_device_id_hwtcl 0
set_component_parameter_value pf3_vendor_id_hwtcl 0
set_component_parameter_value pf3_device_id_hwtcl 0
set_component_parameter_value pf3_vf_device_id_hwtcl 0
set_component_parameter_value pf3_revision_id_hwtcl 0
set_component_parameter_value pf3_class_code_hwtcl 0
set_component_parameter_value pf3_subclass_code_hwtcl 0
set_component_parameter_value pf3_pci_prog_intfc_byte_hwtcl 0
set_component_parameter_value pf3_subsystem_vendor_id_hwtcl 0
set_component_parameter_value pf3_subsystem_device_id_hwtcl 0
set_component_parameter_value pf4_vendor_id_hwtcl 0
set_component_parameter_value pf4_device_id_hwtcl 0
set_component_parameter_value pf4_vf_device_id_hwtcl 0
set_component_parameter_value pf4_revision_id_hwtcl 0
set_component_parameter_value pf4_class_code_hwtcl 0
set_component_parameter_value pf4_subclass_code_hwtcl 0
set_component_parameter_value pf4_pci_prog_intfc_byte_hwtcl 0
set_component_parameter_value pf4_subsystem_vendor_id_hwtcl 0
set_component_parameter_value pf4_subsystem_device_id_hwtcl 0
set_component_parameter_value pf5_vendor_id_hwtcl 0
set_component_parameter_value pf5_device_id_hwtcl 0
set_component_parameter_value pf5_vf_device_id_hwtcl 0
set_component_parameter_value pf5_revision_id_hwtcl 0
set_component_parameter_value pf5_class_code_hwtcl 0
set_component_parameter_value pf5_subclass_code_hwtcl 0
set_component_parameter_value pf5_pci_prog_intfc_byte_hwtcl 0
set_component_parameter_value pf5_subsystem_vendor_id_hwtcl 0
set_component_parameter_value pf5_subsystem_device_id_hwtcl 0
set_component_parameter_value pf6_vendor_id_hwtcl 0
set_component_parameter_value pf6_device_id_hwtcl 0
set_component_parameter_value pf6_vf_device_id_hwtcl 0
set_component_parameter_value pf6_revision_id_hwtcl 0
set_component_parameter_value pf6_class_code_hwtcl 0
set_component_parameter_value pf6_subclass_code_hwtcl 0
set_component_parameter_value pf6_pci_prog_intfc_byte_hwtcl 0
set_component_parameter_value pf6_subsystem_vendor_id_hwtcl 0
set_component_parameter_value pf6_subsystem_device_id_hwtcl 0
set_component_parameter_value pf7_vendor_id_hwtcl 0
set_component_parameter_value pf7_device_id_hwtcl 0
set_component_parameter_value pf7_vf_device_id_hwtcl 0
set_component_parameter_value pf7_revision_id_hwtcl 0
set_component_parameter_value pf7_class_code_hwtcl 0
set_component_parameter_value pf7_subclass_code_hwtcl 0
set_component_parameter_value pf7_pci_prog_intfc_byte_hwtcl 0
set_component_parameter_value pf7_subsystem_vendor_id_hwtcl 0
set_component_parameter_value pf7_subsystem_device_id_hwtcl 0
set_component_parameter_value pf_msi_support_hwtcl 0
set_component_parameter_value pf0_msi_multi_message_capable_hwtcl 4
set_component_parameter_value pf1_msi_multi_message_capable_hwtcl 4
set_component_parameter_value pf2_msi_multi_message_capable_hwtcl 4
set_component_parameter_value pf3_msi_multi_message_capable_hwtcl 4
set_component_parameter_value pf4_msi_multi_message_capable_hwtcl 4
set_component_parameter_value pf5_msi_multi_message_capable_hwtcl 4
set_component_parameter_value pf6_msi_multi_message_capable_hwtcl 4
set_component_parameter_value pf7_msi_multi_message_capable_hwtcl 4
set_component_parameter_value pf_enable_function_msix_support_hwtcl 0
set_component_parameter_value vf_msix_cap_present_hwtcl 0
set_component_parameter_value pf0_msix_table_size_hwtcl 0
set_component_parameter_value pf0_msix_table_offset_hwtcl 0
set_component_parameter_value pf0_msix_table_bir_hwtcl 0
set_component_parameter_value pf0_msix_pba_offset_hwtcl 0
set_component_parameter_value pf0_msix_pba_bir_hwtcl 0
set_component_parameter_value pf1_msix_table_size_hwtcl 0
set_component_parameter_value pf1_msix_table_offset_hwtcl 0
set_component_parameter_value pf1_msix_table_bir_hwtcl 0
set_component_parameter_value pf1_msix_pba_offset_hwtcl 0
set_component_parameter_value pf1_msix_pba_bir_hwtcl 0
set_component_parameter_value pf2_msix_table_size_hwtcl 0
set_component_parameter_value pf2_msix_table_offset_hwtcl 0
set_component_parameter_value pf2_msix_table_bir_hwtcl 0
set_component_parameter_value pf2_msix_pba_offset_hwtcl 0
set_component_parameter_value pf2_msix_pba_bir_hwtcl 0
set_component_parameter_value pf3_msix_table_size_hwtcl 0
set_component_parameter_value pf3_msix_table_offset_hwtcl 0
set_component_parameter_value pf3_msix_table_bir_hwtcl 0
set_component_parameter_value pf3_msix_pba_offset_hwtcl 0
set_component_parameter_value pf3_msix_pba_bir_hwtcl 0
set_component_parameter_value pf4_msix_table_size_hwtcl 0
set_component_parameter_value pf4_msix_table_offset_hwtcl 0
set_component_parameter_value pf4_msix_table_bir_hwtcl 0
set_component_parameter_value pf4_msix_pba_offset_hwtcl 0
set_component_parameter_value pf4_msix_pba_bir_hwtcl 0
set_component_parameter_value pf5_msix_table_size_hwtcl 0
set_component_parameter_value pf5_msix_table_offset_hwtcl 0
set_component_parameter_value pf5_msix_table_bir_hwtcl 0
set_component_parameter_value pf5_msix_pba_offset_hwtcl 0
set_component_parameter_value pf5_msix_pba_bir_hwtcl 0
set_component_parameter_value pf6_msix_table_size_hwtcl 0
set_component_parameter_value pf6_msix_table_offset_hwtcl 0
set_component_parameter_value pf6_msix_table_bir_hwtcl 0
set_component_parameter_value pf6_msix_pba_offset_hwtcl 0
set_component_parameter_value pf6_msix_pba_bir_hwtcl 0
set_component_parameter_value pf7_msix_table_size_hwtcl 0
set_component_parameter_value pf7_msix_table_offset_hwtcl 0
set_component_parameter_value pf7_msix_table_bir_hwtcl 0
set_component_parameter_value pf7_msix_pba_offset_hwtcl 0
set_component_parameter_value pf7_msix_pba_bir_hwtcl 0
set_component_parameter_value pf0_vf_msix_tbl_size_hwtcl 0
set_component_parameter_value pf0_vf_msix_tbl_offset_hwtcl 0
set_component_parameter_value pf0_vf_msix_tbl_bir_hwtcl 0
set_component_parameter_value pf0_vf_msix_pba_offset_hwtcl 0
set_component_parameter_value pf0_vf_msix_pba_bir_hwtcl 0
set_component_parameter_value pf1_vf_msix_tbl_size_hwtcl 0
set_component_parameter_value pf1_vf_msix_tbl_offset_hwtcl 0
set_component_parameter_value pf1_vf_msix_tbl_bir_hwtcl 0
set_component_parameter_value pf1_vf_msix_pba_offset_hwtcl 0
set_component_parameter_value pf1_vf_msix_pba_bir_hwtcl 0
set_component_parameter_value pf2_vf_msix_tbl_size_hwtcl 0
set_component_parameter_value pf2_vf_msix_tbl_offset_hwtcl 0
set_component_parameter_value pf2_vf_msix_tbl_bir_hwtcl 0
set_component_parameter_value pf2_vf_msix_pba_offset_hwtcl 0
set_component_parameter_value pf2_vf_msix_pba_bir_hwtcl 0
set_component_parameter_value pf3_vf_msix_tbl_size_hwtcl 0
set_component_parameter_value pf3_vf_msix_tbl_offset_hwtcl 0
set_component_parameter_value pf3_vf_msix_tbl_bir_hwtcl 0
set_component_parameter_value pf3_vf_msix_pba_offset_hwtcl 0
set_component_parameter_value pf3_vf_msix_pba_bir_hwtcl 0
set_component_parameter_value pf0_interrupt_pin_hwtcl inta
set_component_parameter_value pf1_interrupt_pin_hwtcl inta
set_component_parameter_value pf2_interrupt_pin_hwtcl inta
set_component_parameter_value pf3_interrupt_pin_hwtcl inta
set_component_parameter_value pf4_interrupt_pin_hwtcl inta
set_component_parameter_value pf5_interrupt_pin_hwtcl inta
set_component_parameter_value pf6_interrupt_pin_hwtcl inta
set_component_parameter_value pf7_interrupt_pin_hwtcl inta
set_component_parameter_value pf0_intr_line_hwtcl 0
set_component_parameter_value pf1_intr_line_hwtcl 0
set_component_parameter_value pf2_intr_line_hwtcl 0
set_component_parameter_value pf3_intr_line_hwtcl 0
set_component_parameter_value pf4_intr_line_hwtcl 0
set_component_parameter_value pf5_intr_line_hwtcl 0
set_component_parameter_value pf6_intr_line_hwtcl 0
set_component_parameter_value pf7_intr_line_hwtcl 0
set_component_parameter_value app_msi_addr_pf_hwtcl 64
set_component_parameter_value app_msi_data_pf_hwtcl 16
set_component_parameter_value app_msi_mask_pf_hwtcl 32
set_component_parameter_value app_msi_msg_en_pf_hwtcl 3
set_component_parameter_value link2csr_width_hwtcl 16
set_component_parameter_value lmi_width_hwtcl 8
set_component_parameter_value cseb_route_to_avl_rx_st_hwtcl 0
set_component_parameter_value test_cseb_switch_hwtcl 0
set_component_parameter_value cseb_temp_busy_crs_hwtcl 0
set_component_parameter_value rx_polinv_soft_logic_enable 0
set_component_parameter_value enable_soft_dfe 0
set_component_parameter_value enable_gen3phase2eq_timechange 0
set_component_parameter_value gen3_coeff_3_ber_meas_hwtcl 12ms
set_component_parameter_value slave_address_map_0_hwtcl 9
set_component_parameter_value slave_address_map_2_hwtcl 0
set_component_parameter_value slave_address_map_2_hprxm_hwtcl 0
set_component_parameter_value slave_address_map_4_hwtcl 15
set_component_parameter_value design_environment_hwtcl QSYS
set_component_parameter_value tlp_inspector_hwtcl 0
set_component_parameter_value tlp_inspector_use_signal_probe_hwtcl 0
set_component_parameter_value tlp_inspector_use_thin_rx_master 0
set_component_parameter_value tlp_insp_trg_dw0_hwtcl 2049
set_component_parameter_value tlp_insp_trg_dw1_hwtcl 0
set_component_parameter_value tlp_insp_trg_dw2_hwtcl 0
set_component_parameter_value enable_ast_trs_hwtcl 0
set_component_parameter_value ast_trs_num_desc_hwtcl 16
set_component_parameter_value ast_trs_txdata_width_hwtcl 256
set_component_parameter_value ast_trs_txdesc_width_hwtcl 256
set_component_parameter_value ast_trs_txstatus_width_hwtcl 256
set_component_parameter_value ast_trs_rxdata_width_hwtcl 256
set_component_parameter_value ast_trs_rxdesc_width_hwtcl 256
set_component_parameter_value ast_trs_txmty_width_hwtcl 32
set_component_parameter_value ast_trs_rxmty_width_hwtcl 32
set_component_parameter_value dma_use_scfifo_ext_hwtcl 0
set_component_parameter_value use_dynamic_design_example_hwtcl 1
set_component_parameter_value use_rpbfm_pro 0
set_component_parameter_value silicon_rev 20nm5es
set_component_parameter_value hip_ac_pwr_clk_freq_in_hz 250000000
set_component_parameter_value ko_compl_data 773
set_component_parameter_value ko_compl_header 195
set_component_parameter_value acknack_base 0
set_component_parameter_value acknack_set false
set_component_parameter_value advance_error_reporting disable
set_component_parameter_value app_interface_width avst_256bit
set_component_parameter_value arb_upfc_30us_counter 0
set_component_parameter_value arb_upfc_30us_en enable
set_component_parameter_value aspm_config_management true
set_component_parameter_value aspm_patch_disable enable_both
